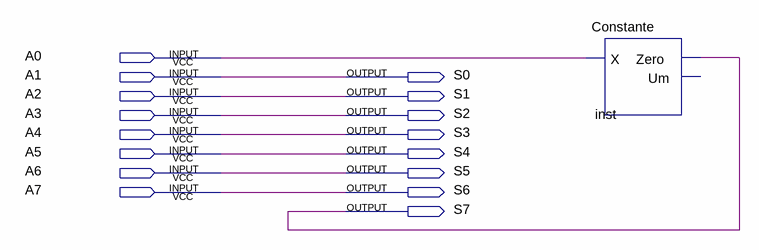
[diagram p0: schematic sheet]
// Quartus schematic UmShiftaDireita.bdf as structural Verilog: 1 symbols, 16 pins
module UmShiftaDireita (
  input  A0,
  input  A1,
  input  A2,
  input  A3,
  input  A4,
  input  A5,
  input  A6,
  input  A7,
  output S0,
  output S1,
  output S2,
  output S3,
  output S4,
  output S5,
  output S6,
  output S7
);

  Constante inst (.X(A0), .Zero(S7));  // open: Um

  assign S0 = A1;
  assign S1 = A2;
  assign S2 = A3;
  assign S3 = A4;
  assign S4 = A5;
  assign S5 = A6;
  assign S6 = A7;
endmodule
